# EAGLE design Qwiic UV Sensor - ZOPT220x (EAGLE 7.7.0)
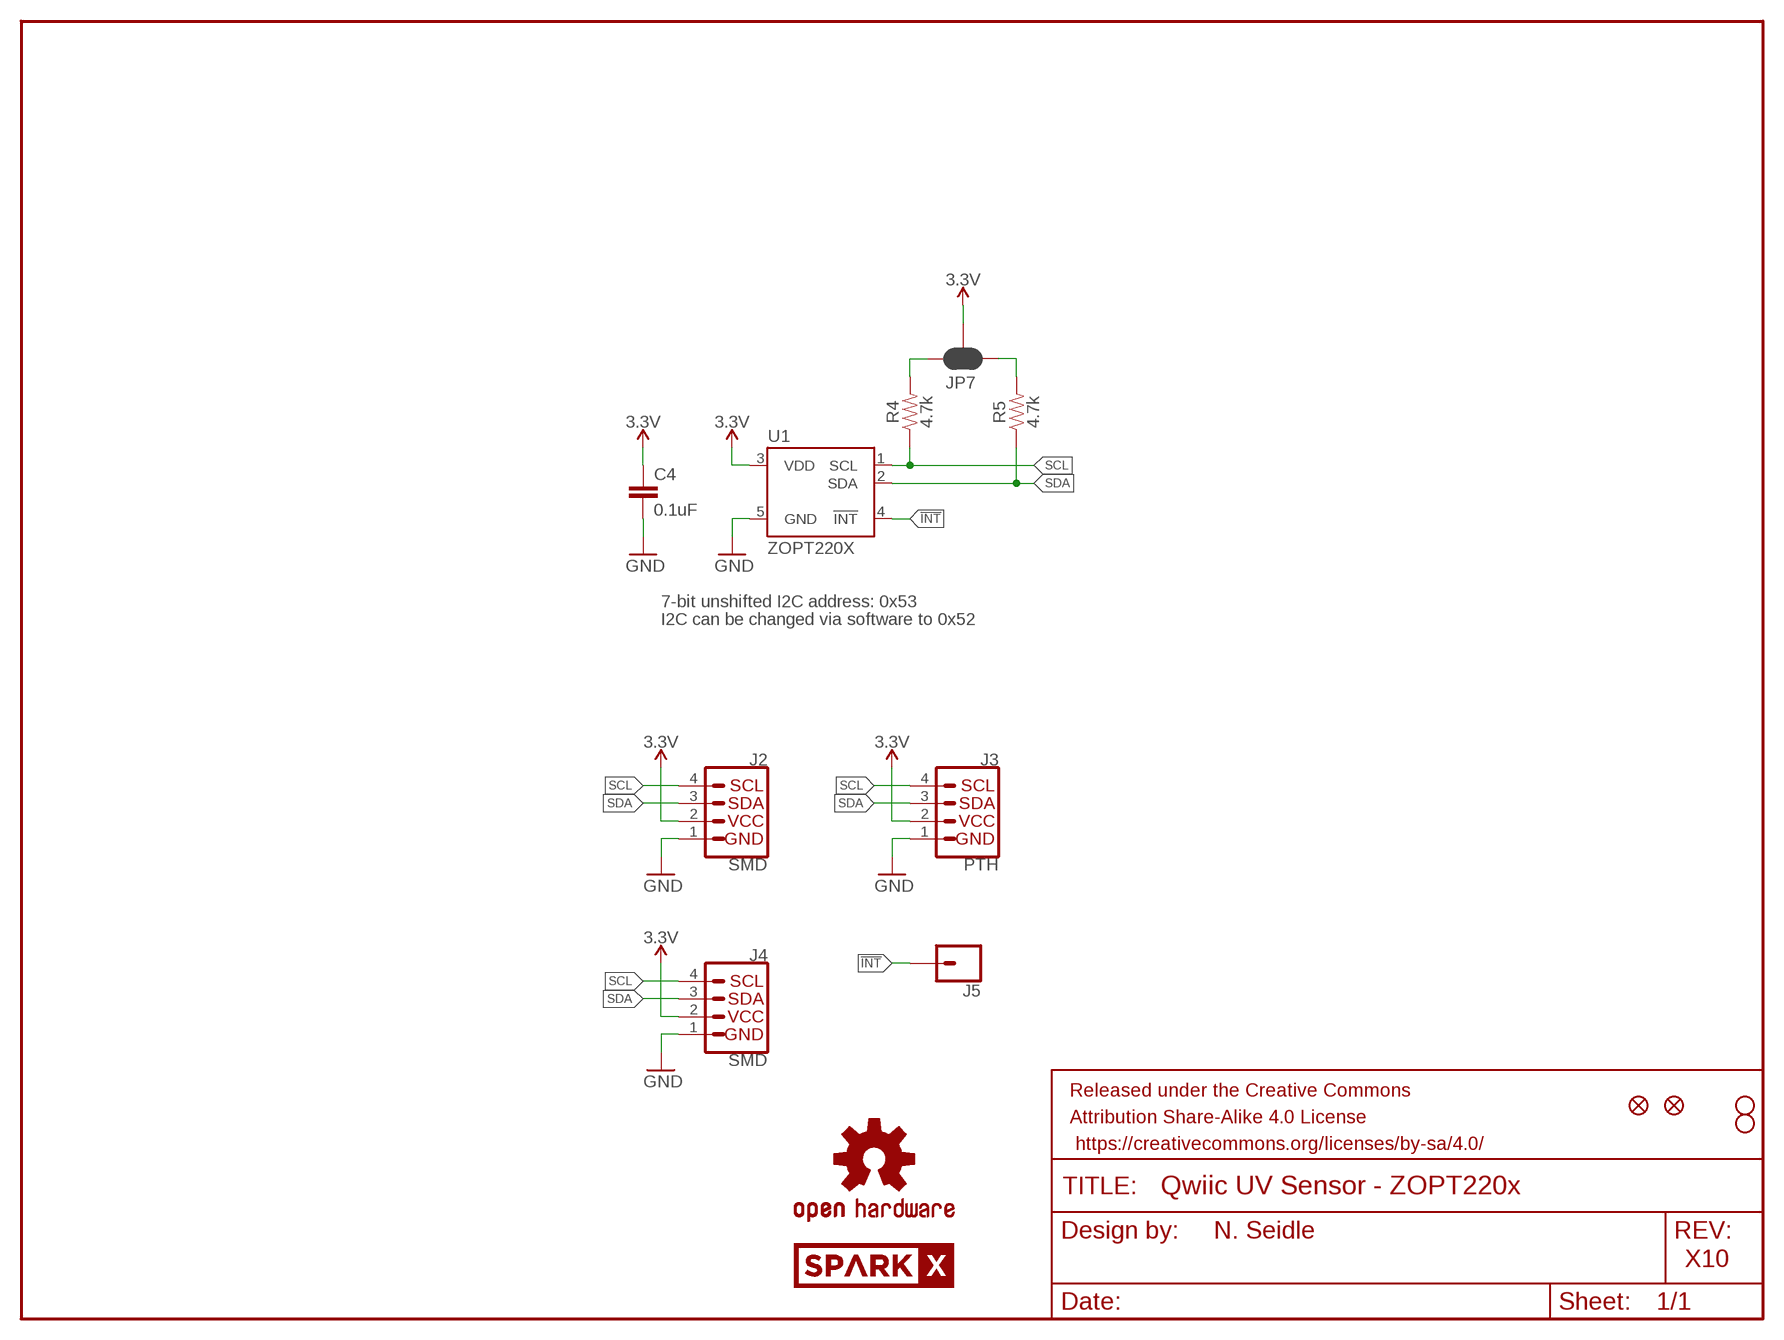
[diagram p0: schematic, sheet 1]

## Parts
C4  0.1uF  0.1UF-0603-25V-(+80/-20%)  [0603]
FRAME1  FRAME-LETTER  [CREATIVE_COMMONS]
J2  SMD  I2C_STANDARDJS-1MM  [1X04_1MM_RA]
J3  PTH  I2C_STANDARD_NO_SILK  [1X04_NO_SILK]
J4  SMD  I2C_STANDARDJS-1MM  [1X04_1MM_RA]
J5  CONN_01PTH_NO_SILK_YES_STOP  [1X01_NO_SILK]
JP2  FIDUCIALUFIDUCIAL  [MICRO-FIDUCIAL]
JP3  STAND-OFF  [STAND-OFF]
JP4  STAND-OFF  [STAND-OFF]
JP6  FIDUCIALUFIDUCIAL  [MICRO-FIDUCIAL]
JP7  JUMPER-SMT_3_2-NC_PASTE_SILK  [SMT-JUMPER_3_2-NC_PASTE_SILK]
LOGO1  OSHW-LOGOMINI  [OSHW-LOGO-MINI]
R4  4.7k  4.7KOHM-0603-1/10W-1%  [0603]
R5  4.7k  4.7KOHM-0603-1/10W-1%  [0603]
U1  ZOPT220X  [LGA6]
U$1  SPARKX-LOGO4  [SPARKX-MEDIUM]
U$2  SPARKX-LOGO4  [SPARKX-MEDIUM]

## Nets
3.3V: C4.1 J2.2(VCC) J3.2(VCC) J4.2(VCC) JP7.2 U1.3(VDD)
!INT: J5.1 U1.4(!INT)
GND: C4.2 J2.1(GND) J3.1(GND) J4.1(GND) U1.5(GND)
N$1: JP7.1 R5.2
N$2: JP7.3 R4.2
SCL: J2.4(SCL) J3.4(SCL) J4.4(SCL) R4.1 U1.1(SCL)
SDA: J2.3(SDA) J3.3(SDA) J4.3(SDA) R5.1 U1.2(SDA)

## Notes on the sheet
- 7-bit unshifted I2C address: 0x53
- I2C can be changed via software to 0x52
- N. Seidle
- X10

## Library data of the parts
C4 = SparkFun-Capacitors:0.1UF: 0.1µF ceramic capacitors A capacitor is a passive two-terminal electrical component used to store electrical energy temporarily in an electric field.; PROD_ID: CAP-00810
FRAME1 = SparkFun-Aesthetics:FRAME-LETTER: Schematic Frame - Letter Standard 8.5x11 US Letter frame
J2-J4 = SparkX:I2C_STANDARD: SparkFun I2C Standard Pinout Header SparkFun has standardized on a pinout for all I2C based sensor breakouts. This pinout allows I2C boards to be plugged directly into the headers on Arduino Uno compatible boards, and to be daisy chained easily. Example SparkFun Products: SparkFun Atmospheric Sensor Breakout - BME280 <https://www.sparkfun.com/products/13676> SparkFun Altitude/Pressure Sensor Breakout - MPL3115A2 <https://www.sparkfun.com/products/11084> SparkFun TOF Range Finder Sensor - VL6180 <https://www.sparkfun.com/products/12785>
J5 = SparkFun-Connectors:CONN_01: Single connection point. Often used as Generic Header-pin footprint for 0.1 inch spaced/style header connections On any of the 0.1 inch spaced packages, you can populate with these: Break Away Headers - Straight <https://www.sparkfun.com/products/116> (PRT-00116) Break Away Male Headers - Right Angle <https://www.sparkfun.com/products/553> (PRT-00553) Female Headers <https://www.sparkfun.com/products/115> (PRT-00115) Break Away Headers - Machine Pin <https://www.sparkfun.com/products/117> (PRT-00117) Break Away Female Headers - Swiss Machine Pin <https://www.sparkfun.com/products/743> (PRT-00743) This device is also useful as a general connection point to wire up your design to another part of your project. Our various solder wires solder well into these plated through hole pads. Hook-Up Wire - Assortment (Stranded, 22 AWG) <https://www.sparkfun.com/products/11375> (PRT-11375) Hook-Up Wire - Assortment (Solid Core, 22 AWG) <https://www.sparkfun.com/products/11367> (PRT-11367) View the entire wire category on our website here <https://www.sparkfun.com/categories/141> Special notes: SMTSO-256-ET is a "flush mount" nut for a 4-40 screw. We mostly use this on specialty testbeds; it is a nice way to connect hardware to your PCB at an adjustable hieght. Also note, the SNAP packages are for using a snappable style connector. We sell a baggie of snaps and they are also used on two LilyPad designs: Snap Assortment - 30 pack (male and female) <https://www.sparkfun.com/products/11347> (DEV-11347) LilyPad Arduino SimpleSnap <https://www.sparkfun.com/products/10941> (DEV-10941) LilyPad SimpleSnap Protoboard <https://www.sparkfun.com/products/10940> (DEV-10940)
JP2 JP6 = SparkFun:FIDUCIAL: Fiducial Alignment Points Various fiducial points for machine vision alignment.
JP3 JP4 = SparkFun:STAND-OFF: Stand Off This is the mechanical footprint for a #4 phillips button head screw. Use the keepout ring to avoid running the screw head into surrounding components. SKU : PRT-00447
JP7 = SparkFun-Jumpers:JUMPER-SMT_3_2-NC_PASTE: Normally closed solder jumper (2 of 2 connections) This jumper has an aperture in the stencil to allow solder paste to bridge both connections. Both connections are normally closed (NC). Wick off the solder to open the connection(s). Reapply solder to reclose the connection(s).
LOGO1 = SparkFun-Aesthetics:OSHW-LOGO: Open-Source Hardware (OSHW) Logo This logo indicates the piece of hardware it is found on incorporates a OSHW license and/or adheres to the definition of open source hardware found here: http://freedomdefined.org/OSHW
R4 R5 = SparkFun-Resistors:4.7KOHM: 4.7kΩ resistor A resistor is a passive two-terminal electrical component that implements electrical resistance as a circuit element. Resistors act to reduce current flow, and, at the same time, act to lower voltage levels within circuits. - Wikipedia; PROD_ID: RES-07857
U1 = SparkX:ZOPT220X
U$1 U$2 = SparkX:SPARKX-LOGO

## Board
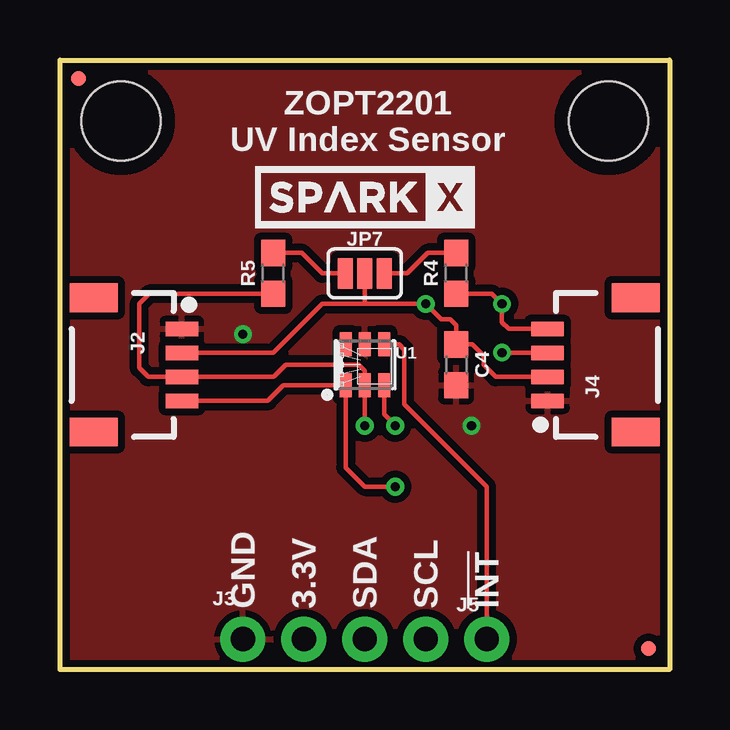
[diagram p1: board, top side]
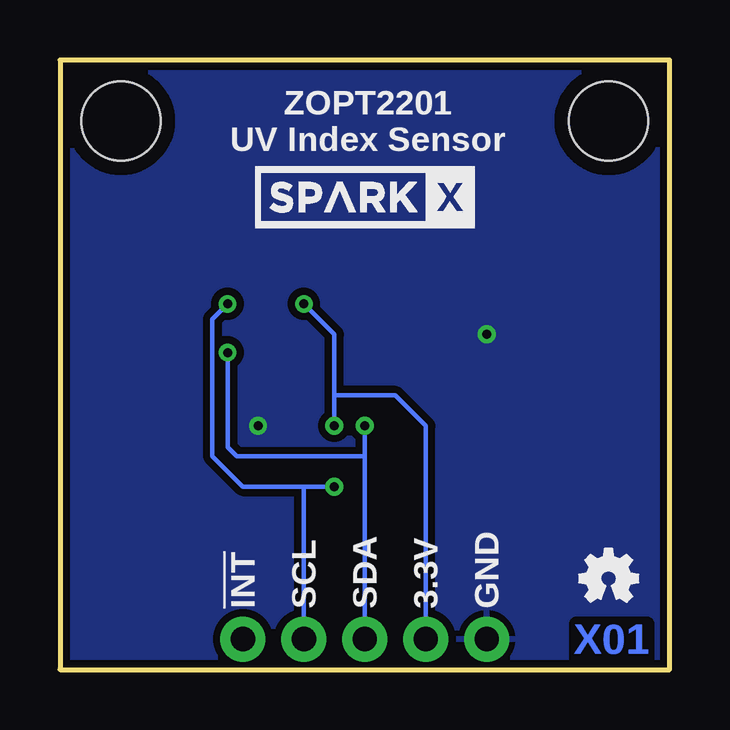
[diagram p2: board, bottom side, seen from below]

Size 25.4 x 25.4 mm. Coordinates in mm from the lower left corner, seen from the top.
Outline: 0,0 0,25.4 25.4,25.4 25.4,0 0,0
Copper layers (1*16): Top 0.035mm / dielectric 1.5mm / Bottom 0.035mm
Design rules "SparkFun-2-layer-TIGHT": minimum track width 7mil, minimum drill 15mil, track to track 7mil, track to pad 7mil, pad to pad 7mil, via to via 7mil, smd to smd 7mil, copper to edge 7mil, drill to drill 7mil, minimum pad ring 7mil, minimum via ring 7mil, stop-mask expansion 4mil, vias tented up to drill 25mil, thermal gap 10mil

### Footprints (pad centres in the part's own frame; a part is rotated, then mirrored left to right if it is on the bottom)
0603 = smd 1.1 x 1: 1 -0.85,0; 2 0.85,0
1X04_1MM_RA = smd 0.6 x 1.35: 1 -1.5,0; 2 -0.5,0; 3 0.5,0; 4 1.5,0 | smd 1.2 x 2: NC1 2.8,-3.675; NC2 -2.8,-3.675
1X04_NO_SILK = drill 1.016 pad 1.88: 1 0,0; 2 2.54,0; 3 5.08,0; 4 7.62,0
1X01_NO_SILK = drill 1.016 pad 1.88: 1 0,0
MICRO-FIDUCIAL = smd 0.635 x 0.635: 1 0,0
STAND-OFF = hole 3.302: 0,0
SMT-JUMPER_3_2-NC_PASTE_SILK = smd 0.635 x 1.27: 1 -0.813,0; 2 0,0; 3 0.813,0
LGA6 = smd 0.5 x 1: 1 -0.8,-0.85; 2 0,-0.85; 3 0.8,-0.85; 4 0.8,0.85; 5 0,0.85; 6 -0.8,0.85

### Placement (x,y rotation side)
C4  16.51,12.7 270 top
FRAME1  -20.32,-17.78 0 top  (outside the outline)
J2  5.08,12.7 270 top
J3  7.62,1.27 0 top
J4  20.32,12.7 90 top
J5  17.78,1.27 0 top
JP2  24.51,0.89 0 top
JP3  2.54,22.86 0 top
JP4  22.86,22.86 0 top
JP6  0.76,24.64 0 top
JP7  12.7,16.51 0 top
LOGO1  2.54,3.81 0 bottom
R4  16.51,16.51 90 top
R5  8.89,16.51 90 top
U1  12.7,12.7 0 top
U$1  12.7,19.68 0 bottom
U$2  12.7,19.68 0 top

### Tracks (layer width: path | path; a pad name or v marks a point on that pad's centre or on a via)
3.3V  (via drill 0.38)
  Top 0.178: J2.2 8.88,13.2 10.92,15.24 12.7,15.24 | U1.3 13.5,10.63 v13.97,10.16 | 12.7,15.24 v15.24,15.24 15.88,14.61 16.26,14.61 16.51,14.35 C4.1 17.18,13.55 17.65,13.08 17.65,12.7 18.15,12.2 J4.2 | JP7.2 12.7,15.24
  Bottom 0.178: v13.97,10.16 13.97,11.43 | J3.2 10.16,10.16 11.43,11.43 13.97,11.43 | 13.97,11.43 13.97,13.97 v15.24,15.24
!INT
  Top 0.178: J5.1 17.78,7.62 14.35,11.05 14.35,13.34 14.14,13.55 U1.4
GND  (via drill 0.38)
  other vias: 7.62,13.97 17.14,10.16
  pour Bottom (isolate 0.305): 0,0 0,25.4 25.4,25.4 25.4,0
  pour Top (isolate 0.305): 0,0 0,25.4 25.4,25.4 25.4,0
N$1
  Top 0.178: JP7.1 10.92,16.51 10.07,17.36 R5.2
N$2
  Top 0.178: JP7.3 14.48,16.51 15.33,17.36 R4.2
SCL  (via drill 0.38)
  Top 0.178: R4.1 18,15.66 v18.41,15.24 18.41,14.48 18.69,14.2 J4.4 | J2.4 8.66,11.2 9.31,11.85 U1.1 11.9,8.42 12.7,7.62 v13.97,7.62
  Bottom 0.178: v13.97,7.62 15.24,7.62 | J3.4 15.24,7.62 | v18.41,15.24 19.05,14.61 19.05,8.89 17.78,7.62 15.24,7.62
SDA  (via drill 0.38)
  Top 0.178: R5.1 3.72,15.66 3.3,15.24 3.3,12.57 3.67,12.2 J2.3 8.9,12.2 9.4,12.7 12.45,12.7 12.7,12.45 U1.2 v12.7,10.16 | J4.3 18.42,13.2 v18.41,13.21
  Bottom 0.178: 12.7,8.89 18.03,8.89 18.41,9.27 v18.41,13.21 | v12.7,10.16 12.7,8.89 | 12.7,8.89 J3.3

### Text on the board
Bottom: X01
tPlace: ZOPT2201 / UV Index Sensor | GND | 3.3V | SDA | SCL | !INT
bPlace: ZOPT2201 / UV Index Sensor | GND | 3.3V | SDA | SCL | !INT